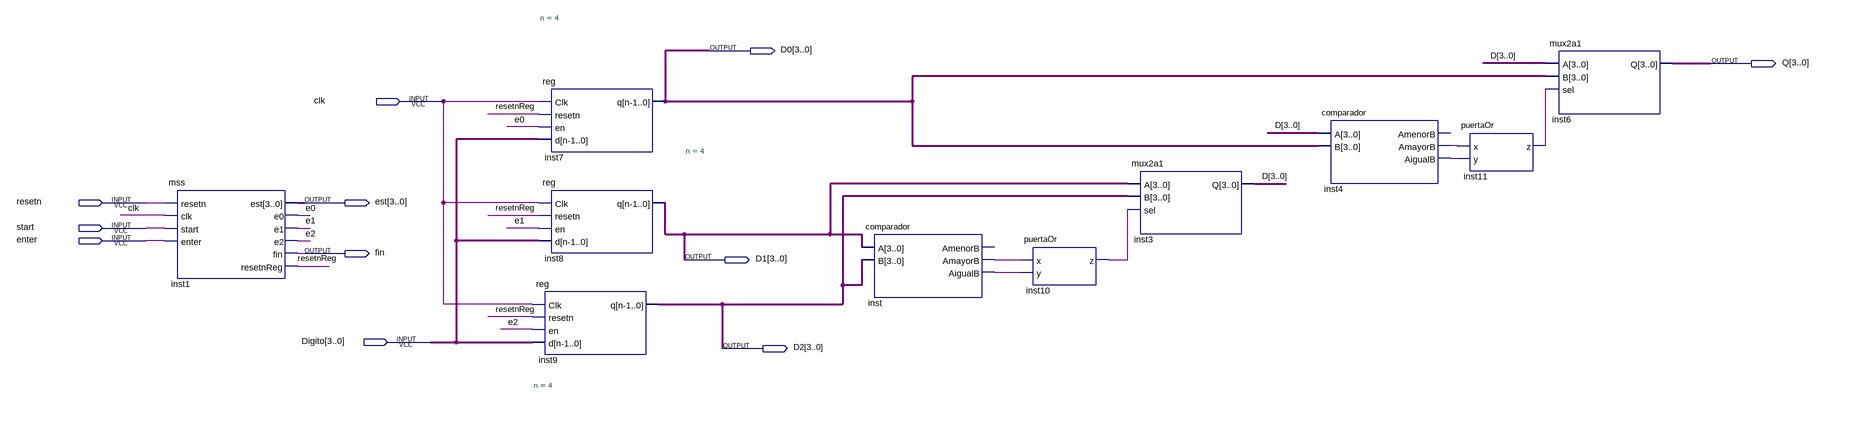
[diagram p0: schematic sheet]
// Quartus schematic ProyectoDigitales.bdf as structural Verilog: 10 symbols, 11 pins
module ProyectoDigitales (
  input  clk,
  input  resetn,
  input  start,
  input  enter,
  input  [3:0] Digito,
  output [3:0] D0,
  output [3:0] Q,
  output [3:0] est,
  output fin,
  output [3:0] D1,
  output [3:0] D2
);

  wire e0, e1, e2, inst4_aigualb, inst4_amayorb, inst10_z, inst11_z, inst_aigualb, inst_amayorb, resetnReg;
  wire [3:0] D;

  mss inst1 (
    .resetn(resetn), .clk(clk), .start(start), .enter(enter), .est(est), .e0(e0), .e1(e1), .e2(e2),
    .fin(fin), .resetnReg(resetnReg));
  \reg  #(.n(4)) inst7 (.Clk(clk), .resetn(resetnReg), .en(e0), .d(Digito), .q(D0));
  \reg  #(.n(4)) inst8 (.Clk(clk), .resetn(resetnReg), .en(e1), .d(Digito), .q(D1));
  \reg  #(.n(4)) inst9 (.Clk(clk), .resetn(resetnReg), .en(e2), .d(Digito), .q(D2));
  comparador inst (.A(D1), .B(D2), .AmayorB(inst_amayorb), .AigualB(inst_aigualb));  // open: AmenorB
  puertaOr inst10 (.x(inst_amayorb), .y(inst_aigualb), .z(inst10_z));
  mux2a1 inst3 (.A(D1), .B(D2), .sel(inst10_z), .Q(D));
  comparador inst4 (.A(D), .B(D0), .AmayorB(inst4_amayorb), .AigualB(inst4_aigualb));  // open: AmenorB
  puertaOr inst11 (.x(inst4_amayorb), .y(inst4_aigualb), .z(inst11_z));
  mux2a1 inst6 (.A(D), .B(D0), .sel(inst11_z), .Q(Q));
endmodule
